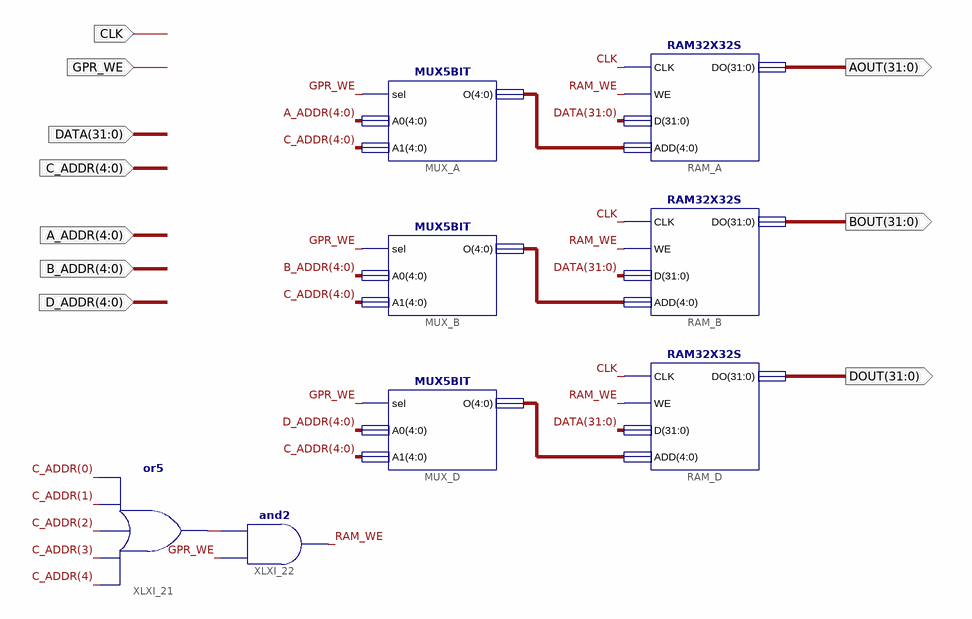
[diagram p0: schematic sheet 1]
// Xilinx ISE schematic GPR.sch (spartan6) as structural Verilog: 8 symbols, 10 ports
module GPR (
  input  GPR_WE,
  input  [31:0] DATA,
  input  [4:0] C_ADDR,
  input  [4:0] A_ADDR,
  input  [4:0] B_ADDR,
  input  [4:0] D_ADDR,
  input  CLK,
  output [31:0] AOUT,
  output [31:0] BOUT,
  output [31:0] DOUT
);

  wire RAM_WE, XLXN_98;
  wire [4:0] XLXN_13, XLXN_19, XLXN_24;

  RAM32X32S RAM_A (.CLK(CLK), .WE(RAM_WE), .D(DATA), .ADD(XLXN_13), .DO(AOUT));
  RAM32X32S RAM_B (.CLK(CLK), .WE(RAM_WE), .D(DATA), .ADD(XLXN_19), .DO(BOUT));
  RAM32X32S RAM_D (.CLK(CLK), .WE(RAM_WE), .D(DATA), .ADD(XLXN_24), .DO(DOUT));
  MUX5BIT MUX_A (.sel(GPR_WE), .A0(A_ADDR), .A1(C_ADDR), .O(XLXN_13));
  MUX5BIT MUX_B (.sel(GPR_WE), .A0(B_ADDR), .A1(C_ADDR), .O(XLXN_19));
  MUX5BIT MUX_D (.sel(GPR_WE), .A0(D_ADDR), .A1(C_ADDR), .O(XLXN_24));
  or XLXI_21 (XLXN_98, C_ADDR[4], C_ADDR[3], C_ADDR[2], C_ADDR[1], C_ADDR[0]);
  and XLXI_22 (RAM_WE, GPR_WE, XLXN_98);
endmodule
